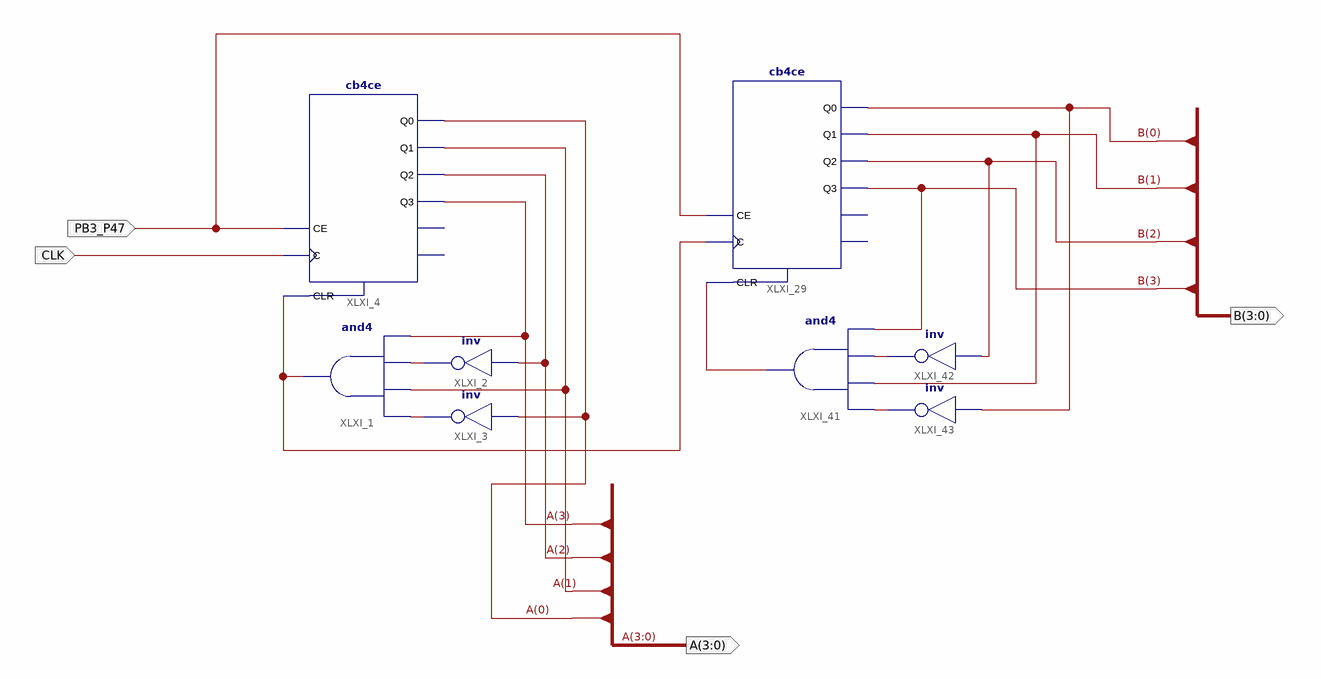
[diagram p0: schematic sheet 1]
// Xilinx ISE schematic counter00_99.sch (spartan6) as structural Verilog: 8 symbols, 4 ports
module counter00_99 (
  input  PB3_P47,
  input  CLK,
  output [3:0] A,
  output [3:0] B
);

  wire XLXN_1, XLXN_2, XLXN_87, XLXN_88, XLXN_89, XLXN_96;

  and XLXI_1 (XLXN_87, A[3], XLXN_1, A[1], XLXN_2);
  not XLXI_2 (XLXN_1, A[2]);
  not XLXI_3 (XLXN_2, A[0]);
  cb4ce XLXI_4 (.C(CLK), .CE(PB3_P47), .CLR(XLXN_87), .Q0(A[0]), .Q1(A[1]), .Q2(A[2]), .Q3(A[3]));  // open: CEO, TC
  and XLXI_41 (XLXN_96, B[3], XLXN_88, B[1], XLXN_89);
  not XLXI_42 (XLXN_88, B[2]);
  not XLXI_43 (XLXN_89, B[0]);
  cb4ce XLXI_29 (
    .C(XLXN_87), .CE(PB3_P47), .CLR(XLXN_96), .Q0(B[0]), .Q1(B[1]), .Q2(B[2]), .Q3(B[3]));  // open: CEO, TC
endmodule
